# EasyEDA Pro project eLight_core.epro, board PCB0
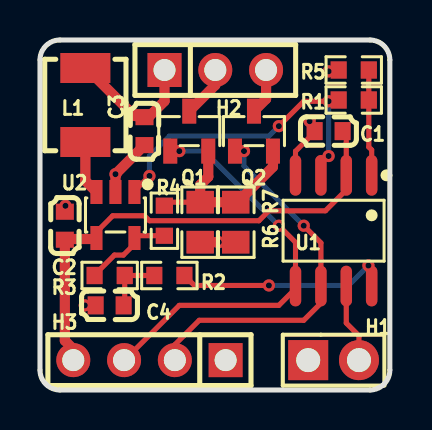
[diagram p7: board, top side]
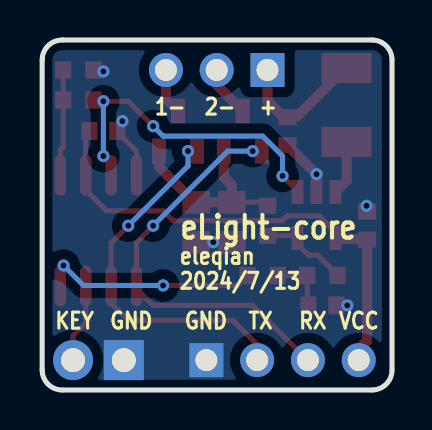
[diagram p8: board, bottom side, seen from below]

Outline 17.5 x 17.5 mm; copper layers: Top Layer, Bottom Layer. Coordinates in mm from the lower left corner of the outline.
Outline path: 0,16.5 0,1 arc(0.29,0.29) 1,0 16.5,0 arc(17.21,0.29) 17.5,1 17.5,16.5 arc(17.21,17.21) 16.5,17.5 1,17.5 arc(0.29,17.21) 0,16.5
Stack: Top Layer 0.035mm / Dielectric1 0.71mm FR4 er 4.5 / Bottom Layer 0.035mm

## Design rules (mm)
spacing safeClearance (default): track to track 0.152, other pairs 0.152 to 0.3
track width trackWidth (default): min 0.127, default 0.254, max 2.54
differential pair differentialPair (default): width min 0.127, default 0.254, max 2.54; gap min 0.152, default 0.152
via viaSize (default): diameter min 0.5, default 0.61, max 10; hole min 0.3, default 0.305, max 6
net GND uses copperRegion1
net $1N3207 uses copperRegion1
net LED+ uses copperRegion1

## Placement (name value [footprint] x y rotation side)
C1  100nF  [C0603]  14.44 12.94 0 top
C2  10uF  [C0603]  1.24 8.21 270 top
C3  10uF  [C0603]  5.23 12.94 90 top
C4  1uF  [C0603]  3.49 4.23 0 top
H1  PZ254V-11-02P  [HDR-TH_2P-P2.54-V-M]  14.69 1.49 0 top
H2  PZ254V-11-03P  [HDR-TH_3P-P2.54-V-M]  8.77 16 0 top
H3  PZ254V-11-04P  [HDR-TH_4P-P2.54-V-M]  5.48 1.49 180 top
L1  2.2uH  [IND-SMD_L4.5-W4.0-1]  2.27 14.25 90 top
Q1  AO3400A  [SOT-23-3_L2.9-W1.3-P1.90-LS2.4-BR]  7.47 12.94 270 top
Q2  AO3400A  [SOT-23-3_L2.9-W1.3-P1.90-LS2.4-BR]  10.7 12.94 270 top
R1  100kΩ  [R0603]  15.69 14.5 180 top
R2  10kΩ  [R0603]  6.47 5.72 180 top
R3  220kΩ  [R0603]  3.49 5.72 180 top
R4  10kΩ  [R0603]  6.22 8.46 90 top
R5  SDNT1608X104F4250FTF  [R0603]  15.69 16 0 top
R6  500mΩ  [R0805]  8.01 8.39 90 top
R7  500mΩ  [R0805]  9.79 8.39 90 top
U1  STC8G1K08A-36I-SOP8  [SOP-8_L5.0-W4.0-P1.27-LS6.0-BL]  14.69 7.97 180 top
U2  SY8006AAC  [SOT-23-5_L3.0-W1.6-P0.95-LS2.8-BR]  3.78 8.75 90 top

## Footprints (pads in the part's own frame, mm; a bottom-side part is the same pattern mirrored in y, then rotated)
C0603
  rect 0.8x0.9 smd: 1(-0.7,0) 2(0.7,0)
HDR-TH_2P-P2.54-V-M
  rect 2x2 hole 1.2: 1(-1.27,0)
  round 2 hole 1.2: 2(1.27,0)
HDR-TH_3P-P2.54-V-M
  rect 1.7x1.7 hole 1.1: 1(-2.54,0)
  round 1.7 hole 1.1: 2(0,0) 3(2.54,0)
HDR-TH_4P-P2.54-V-M
  rect 1.7x1.7 hole 1.1: 1(-3.81,0)
  round 1.7 hole 1.1: 2(-1.27,0) 3(1.27,0) 4(3.81,0)
IND-SMD_L4.5-W4.0-1
  rect 1.5x2.5 smd: 1(-1.85,0) 2(1.85,0)
R0603
  rect 0.806x0.864 smd: 1(-0.753,0) 2(0.753,0)
R0805
  rect 1.133x1.377 smd: 1(-1,0) 2(1,0)
SOP-8_L5.0-W4.0-P1.27-LS6.0-BL
  oval 0.574x2.035 smd: 1(-1.905,-2.768) 2(-0.635,-2.768) 3(0.635,-2.768) 4(1.905,-2.768) 5(1.905,2.768) 6(0.635,2.768) 7(-0.635,2.768) 8(-1.905,2.768)
SOT-23-3_L2.9-W1.3-P1.90-LS2.4-BR
  rect 1.25x0.7 smd: 1(1,-0.95) 2(1,0.95) 3(-1,0)
SOT-23-5_L3.0-W1.6-P0.95-LS2.8-BR
  rect 1.2x0.6 smd: 1(1.15,-0.95) 2(1.15,0) 3(1.15,0.95) 4(-1.15,0.95) 5(-1.15,-0.95)

## Nets
As in the schematic.

## Via types
v1: diameter 0.61, hole 0.305, Top Layer to Bottom Layer, 16 vias

## Routing (per net, layer and track width the routed paths; a pad name or vN(x,y) marks a point on that pad's centre or on a via; arc(x,y) is an arc through that point)
GND: length 9.3
  Top Layer w0.254: v1(14.44,15.93) 14.87,15.93 R5.1 ; U1.4 12.78,11.94 13.74,12.89 C1.1 13.49,13.19 v1(13.49,13.44) ; 2.78,4.23 v1(2.24,4.23)
  Top Layer w0.508: U2.2 v1(3.78,10.79) C3.1 ; R6.1 v1(8.94,7.39) R7.1 ; 1.28,8.99 1.33,9.05 1.33,9.16 v1(1.28,9.21)
VCC: length 24.9
  Top Layer w0.254: C1.2 15.32,12.76 U1.2 15.32,10 14.28,8.96 11.45,8.96 10.95,8.46 5.48,8.46 5.23,8.71 3.64,8.71 2.83,7.9 U2.4
  Top Layer w0.508: U2.4 2.78,7.55 1.24,7.55 1.24,2.47 2.22,1.5
DIM: length 10.9
  Top Layer w0.254: v1(11.45,5.23) 7.72,5.23 R2.1 ; v1(16.43,6.22) 16.59,6.06 U1.8
  Bottom Layer w0.254: v1(11.45,5.23) 15.43,5.23 v1(16.43,6.22)
EN1: length 18.6
  Top Layer w0.254: v1(13.19,8.21) 14.05,7.36 U1.6 14.05,4.34 13.19,3.48 7.97,3.48 6.75,2.27 H3.2 ; Q2.1 v1(10.21,11.94)
  Bottom Layer w0.254: v1(13.19,8.21) 10.21,11.2 v1(10.21,11.94)
EN2: length 20.5
  Top Layer w0.254: v1(11.95,8.21) 12.78,7.38 U1.5 12.78,5.06 11.95,4.23 6.97,4.23 4.23,1.49 H3.3 ; Q1.1 v1(6.97,11.94)
  Bottom Layer w0.254: v1(6.97,11.94) 8.22,11.94 v1(11.95,8.21)
L_EN: length 16.6
  Top Layer w0.254: v1(11.95,13.19) 13.19,14.44 v1(14.44,14.44) 14.5,14.5 R1.2 ; v1(14.44,11.7) 14.05,11.31 U1.3 ; v1(5.48,10.7) 4.73,9.95 U2.1
  Bottom Layer w0.254: v1(11.95,13.19) 11.45,12.69 6.47,12.69 5.48,11.7 v1(5.48,10.7) ; v1(14.44,11.7) v1(14.44,14.44)
LED+: length 6.8
  Top Layer w0.508: L1.2 2.32,16.1 4.72,13.7 5.49,13.7 6.23,14.44 H2.1
LED-: length 9.7
  Top Layer w0.254: R6.2 6.4,9.39 6.22,9.22
  Top Layer w0.508: Q1.2 8.42,10.66 8.01,10.25 R6.2 R7.2 9.89,9.39 11.65,11.16 Q2.2
NTC: length 5.3
  Top Layer w0.254: U1.1 16.59,12 16.45,12.15 R1.1 R5.2
$1N3190: length 2.7
  Top Layer w0.508: L1.1 2.27,10.46 U2.3
$1N3207: length 2.6
  Top Layer w0.508: Q1.3 8.77,15.25 H2.2
$1N7267: length 2.3
  Top Layer w0.508: H2.3 11.31,14.55 Q2.3
$1N42712: length 4.5
  Top Layer w0.254: R4.1 6.22,7.72 4.84,7.72 U2.5 4.73,7.3 4.17,6.75 3.72,6.75 2.73,5.75 R3.2
$1N42727: length 3
  Top Layer w0.254: R2.2 R3.1 4.24,4.28 C4.2
$1N42786: length 4
  Top Layer w0.254: U1.7 15.32,3.35 15.96,2.71 H1.2

## Copper pours and planes (outline as drawn; the poured copper is in the pictures)
GND on Bottom Layer: 0,17.42 17.5,17.42 17.5,0.01 0,0.01

## Text on the board
Bottom Silkscreen Layer: VCC | RX | + | TX | 2- | GND | eleqian | 2024/7/13 | 1- | KEY | eLight-core
